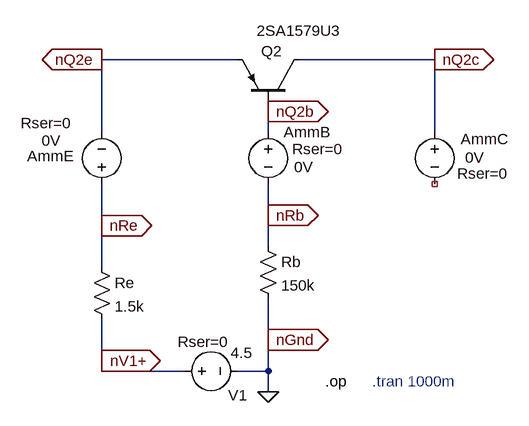
[diagram p0: schematic leakage_current_03.asc]
leakage_current_03.asc, the LTspice schematic file:
Version 4
SHEET 1 880 768
WIRE -80 176 -288 176
WIRE 224 176 16 176
WIRE -32 256 -32 240
WIRE -288 288 -288 176
WIRE -32 288 -32 256
WIRE 224 288 224 176
WIRE -32 416 -32 368
WIRE -288 432 -288 368
WIRE -32 464 -32 416
WIRE -288 496 -288 432
WIRE -32 608 -32 544
WIRE -288 640 -288 576
WIRE -288 656 -288 640
WIRE -160 656 -288 656
WIRE -32 656 -32 608
WIRE -32 656 -80 656
WIRE -32 688 -32 656
FLAG -288 176 nQ2e
IOPIN -288 176 Out
FLAG -288 432 nRe
IOPIN -288 432 Out
FLAG -32 256 nQ2b
IOPIN -32 256 Out
FLAG 224 176 nQ2c
IOPIN 224 176 Out
FLAG -32 688 0
FLAG -288 640 nV1+
IOPIN -288 640 Out
FLAG -32 416 nRb
IOPIN -32 416 Out
FLAG -32 608 nGnd
IOPIN -32 608 Out
SYMBOL pnp 16 240 M270
WINDOW 0 77 59 VLeft 2
WINDOW 3 108 66 VLeft 2
SYMATTR InstName Q2
SYMATTR Value 2SA1579U3
SYMBOL voltage -288 384 R180
WINDOW 0 43 59 Left 2
WINDOW 3 63 83 Left 2
WINDOW 123 0 0 Left 0
WINDOW 39 46 110 Left 2
SYMATTR InstName AmmE
SYMATTR Value 0V
SYMATTR SpiceLine Rser=0
SYMBOL voltage -32 272 R0
WINDOW 3 40 70 Left 2
WINDOW 123 0 0 Left 0
WINDOW 39 37 42 Left 2
SYMATTR Value 0V
SYMATTR SpiceLine Rser=0
SYMATTR InstName AmmB
SYMBOL voltage 224 272 R0
WINDOW 0 40 27 Left 2
WINDOW 3 47 55 Left 2
WINDOW 123 0 0 Left 0
WINDOW 39 35 80 Left 2
SYMATTR InstName AmmC
SYMATTR Value 0V
SYMATTR SpiceLine Rser=0
SYMBOL voltage -176 656 R270
WINDOW 0 -53 97 VTop 2
WINDOW 3 44 103 VBottom 2
WINDOW 123 0 0 Left 0
WINDOW 39 61 44 VBottom 2
SYMATTR InstName V1
SYMATTR Value 4.5
SYMATTR SpiceLine Rser=0
SYMBOL res -304 480 R0
SYMATTR InstName Re
SYMATTR Value 1.5k
SYMBOL res -48 448 R0
SYMATTR InstName Rb
SYMATTR Value 150k
TEXT 56 672 Left 2 !.op
TEXT 128 672 Left 2 ;.tran 1000m

The netlist it stands for:
* leakage_current_03.asc
Q2 nQ2c nQ2b nQ2e 0 2SA1579U3
V§AmmE nRe nQ2e 0V Rser=0
V§AmmB nQ2b nRb 0V Rser=0
V§AmmC nQ2c NC_01 0V Rser=0
V1 nV1+ 0 4.5 Rser=0
Re nRe nV1+ 1.5k
Rb nRb 0 150k
.model NPN NPN
.model PNP PNP
.lib standard.bjt
.op
* .tran 1000m
.backanno
.end